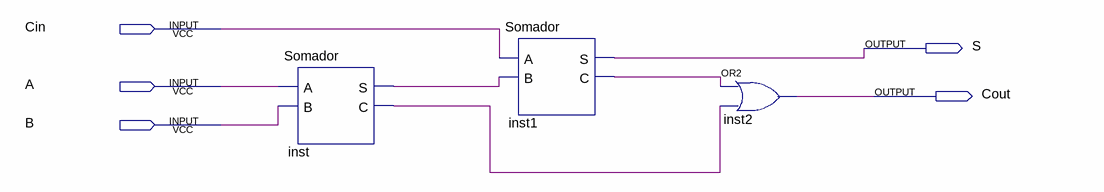
[diagram p0: schematic sheet]
// Quartus schematic Somador_Completo.bdf as structural Verilog: 3 symbols, 5 pins
module Somador_Completo (
  input  Cin,
  input  A,
  input  B,
  output S,
  output Cout
);

  wire inst1_c, inst_c, inst_s;

  Somador inst (.A(A), .B(B), .S(inst_s), .C(inst_c));
  Somador inst1 (.A(Cin), .B(inst_s), .S(S), .C(inst1_c));
  or inst2 (Cout, inst1_c, inst_c);
endmodule
